# EAGLE design tricorder-light-sensors-mk-1.0 (EAGLE 7.5.0)
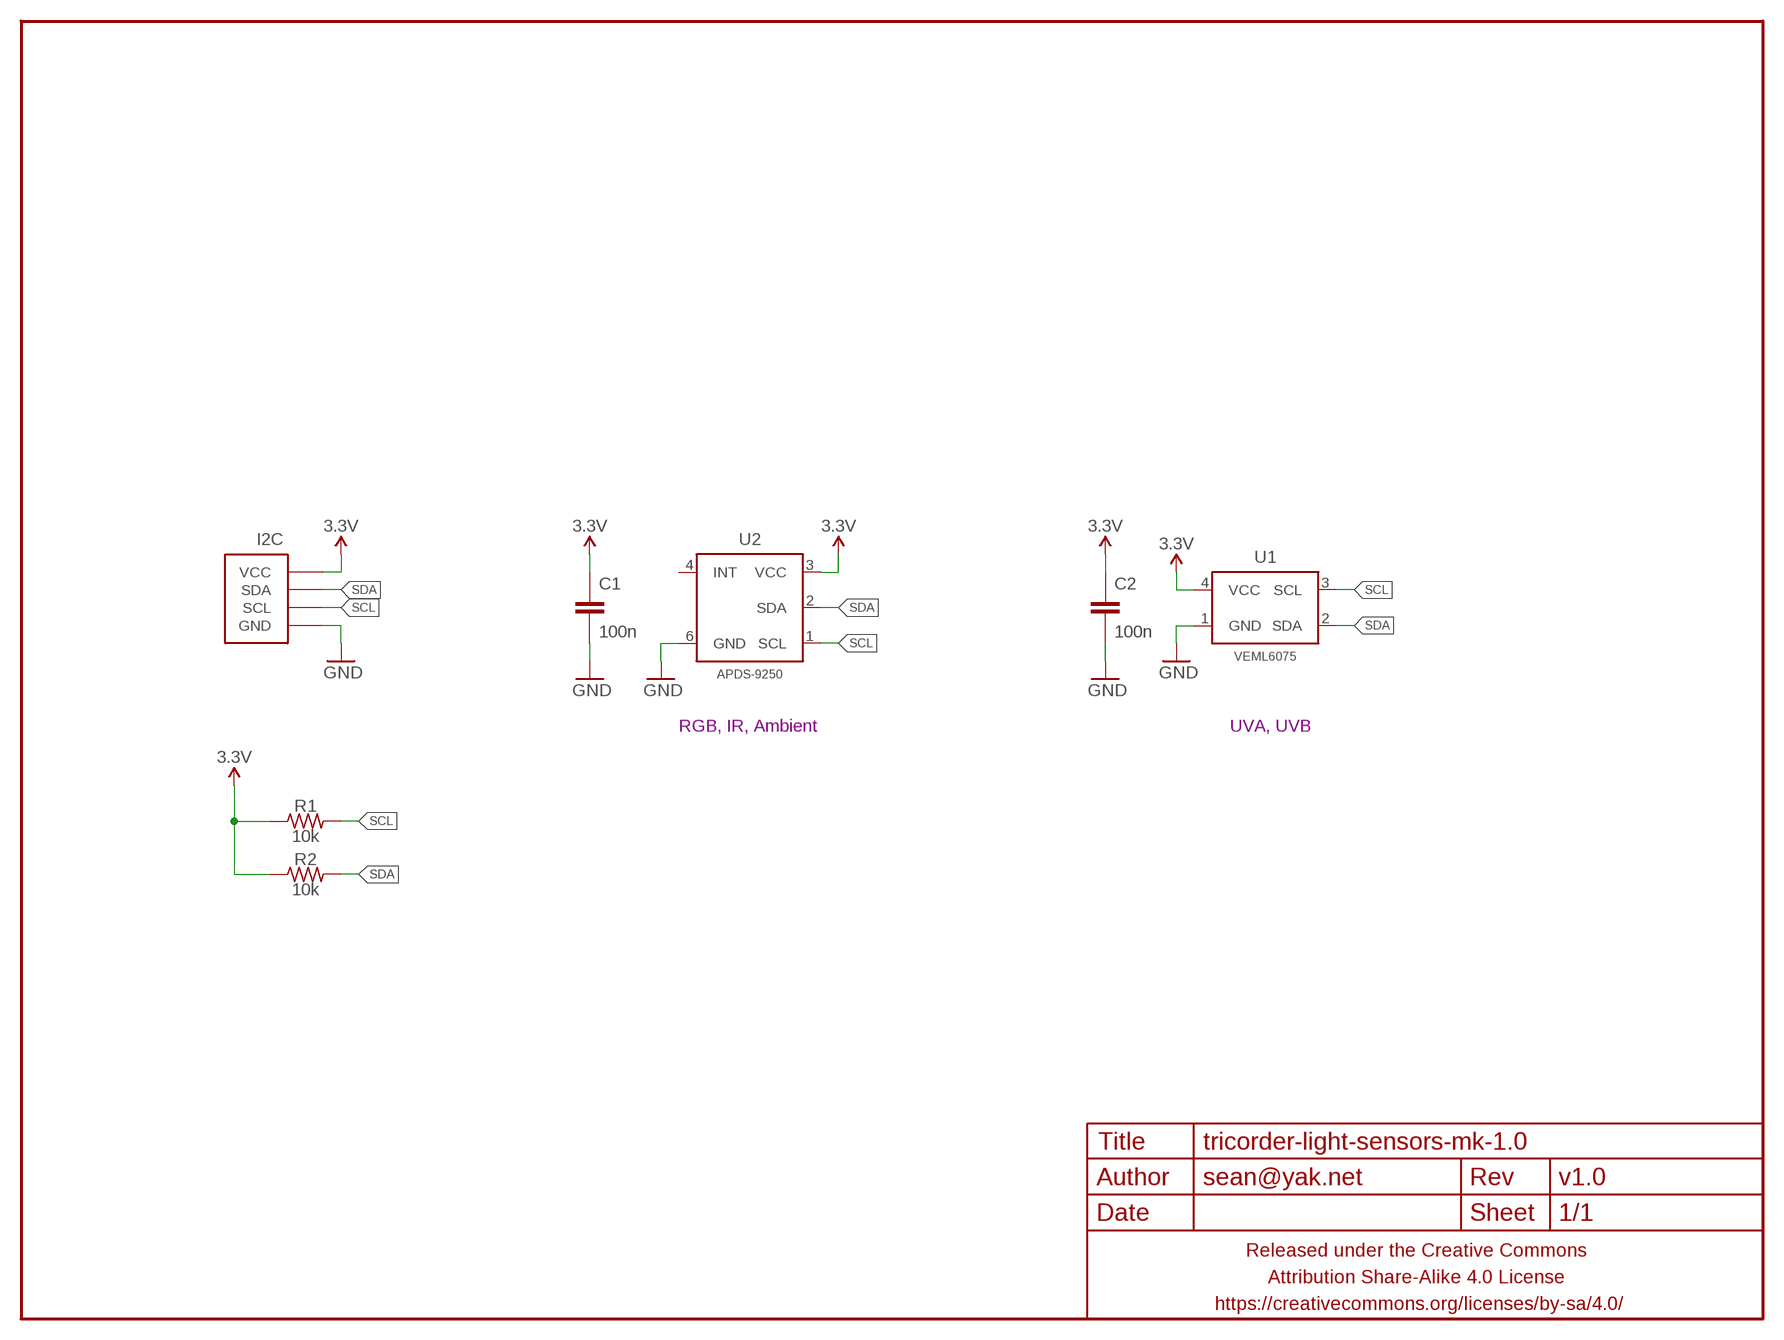
[diagram p0: schematic, sheet 1]

## Parts
C1  100n  CAPACITOR-CERAMICC0603  [C0603]
C2  100n  CAPACITOR-CERAMICC0603  [C0603]
FRAME1  FRAME-LETTERNO_PACKAGE  [DUMMY]
I2C  M04-I2CPTH-0.1IN-CENTERED  [1X04-PTH-VERT-I2C-CENTERED]
R1  10k  RESISTORR0603  [R0603]
R2  10k  RESISTORR0603  [R0603]
U1  VEML6075  [OPLGA4]
U2  APDS-9250  APDS-9250ALT  [APDS-9250-ALT]

## Nets
3.3V: C1.1 C2.1 I2C.VCC R1.1 R2.1 U1.4(VCC) U2.3(VCC)
GND: C1.2 C2.2 I2C.GND U1.1(GND) U2.6(GND)
SCL: I2C.SCL R1.2 U1.3(SCL) U2.1(SCL)
SDA: I2C.SDA R2.2 U1.2(SDA) U2.2(SDA)
Unconnected: U2.4(INT)

## Notes on the sheet
- RGB, IR, Ambient | UVA, UVB

## Library data of the parts
C1 C2 = a_parts:CAPACITOR-CERAMIC: CAPACITOR, European symbol
FRAME1 = a_parts:FRAME-LETTER: Schematic Frame Standard 8.5x11 US Letter frame; DESIGNER: sean@yak.net; VERSION: v1.0
I2C = a_parts:M04-I2C
R1 R2 = a_parts:RESISTOR: RESISTOR, American symbol
U1 = a_parts:VEML6075
U2 = a_parts:APDS-9250

## Board
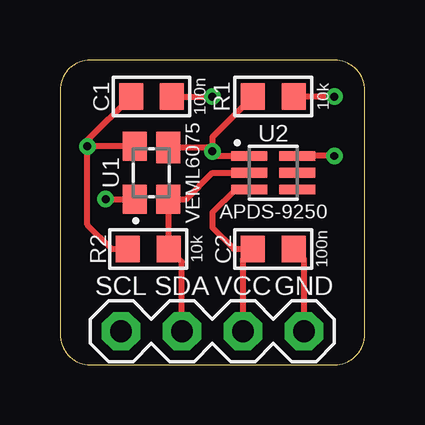
[diagram p1: board, top side]
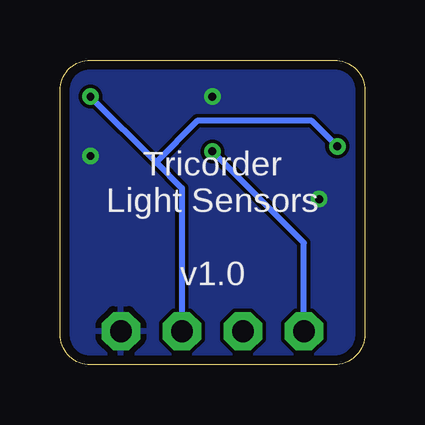
[diagram p2: board, bottom side, seen from below]

Size 12.7 x 12.7 mm. Coordinates in mm from the lower left corner, seen from the top.
Outline: 0,11.43 0,1.27 arc90 1.27,0 11.43,0 arc90 12.7,1.27 12.7,11.43 arc90 11.43,12.7 1.27,12.7 arc90 0,11.43
Copper layers (1*16): Top 0.0356mm / dielectric 1.5011mm / Bottom 0.0356mm
Design rules "LaenPCBOrder2": minimum track width 6mil, minimum drill 13mil, track to track 6mil, track to pad 6mil, pad to pad 6mil, via to via 6mil, smd to smd 6mil, copper to edge 15mil, drill to drill 6mil, minimum pad ring 7mil, minimum via ring 7mil, stop-mask expansion 3mil, vias tented up to drill 20mil, thermal gap 10mil

### Footprints (pad centres in the part's own frame; a part is rotated, then mirrored left to right if it is on the bottom)
C0603 = smd 1 x 1.1: 1 -0.85,0; 2 0.85,0
1X04-PTH-VERT-I2C-CENTERED = drill 0.9 pad 1.6 octagon: GND -3.81,0; SCL 3.81,0; SDA 1.27,0; VCC -1.27,0
R0603 = smd 1 x 1.1: 1 -0.85,0; 2 0.85,0
OPLGA4 = smd 1.2 x 1: 1 -1.1,0.7; 2 -1.1,-0.7; 4 1.1,0.7 | smd 1.3 x 1: 3 1.05,-0.7
APDS-9250-ALT = smd 1.5 x 0.4: 1 -1,0.7; 2 -1,0; 3 -1,-0.7; 4 1,-0.7; 5 1,0; 6 1,0.7

### Placement (x,y rotation side)
C1  3.81,11.18 0 top
C2  8.89,4.83 0 top
FRAME1  0,0 0 top
I2C  6.35,1.4 180 top
R1  8.89,11.18 180 top
R2  3.68,4.83 0 top
U1  3.81,8 90 top
U2  8.89,8 0 top

### Tracks (layer width: path | path; a pad name or v marks a point on that pad's centre or on a via)
3.3V  (via drill 0.33)
  Top 0.25: v1.14,9.1 1.14,5.84 2.16,4.83 R2.1 | I2C.VCC 7.62,4.41 C2.1 7.24,4.83 6.35,5.71 6.35,6.35 7.3,7.3 U2.3 | v11.43,11.18 R1.1 | C1.1 1.14,9.36 v1.14,9.1 | U1.4 v1.14,9.1
  Bottom 0.25: v11.43,11.18 8.7,8.45 | 8.7,8.45 7.62,7.37 I2C.VCC | v1.14,9.1 2.2,10.16 6.99,10.16 8.7,8.45
GND  (via drill 0.33)
  Top 0.25: v1.91,6.9 U1.1 | v11.43,8.7 U2.6 | C2.2 10.16,4.41 I2C.GND | C1.2 v6.35,11.18
  pour Bottom: 0,11.43 0,1.27 arc90 1.27,0 11.43,0 arc90 12.7,1.27 12.7,11.43 arc90 11.43,12.7 1.27,12.7 arc90
SCL  (via drill 0.33)
  Top 0.25: v6.35,8.89 6.54,8.7 U2.1 | v6.35,8.89 6.19,9.05 U1.3 | R1.2 6.35,9.49 v6.35,8.89
  Bottom 0.25: I2C.SCL 2.54,5.08 v6.35,8.89
SDA
  Top 0.25: U2.2 6.35,8 5.25,6.9 U1.2 4.51,4.85 R2.2 5.08,4.28 I2C.SDA

### Text on the board
bPlace: Tricorder / Light Sensors